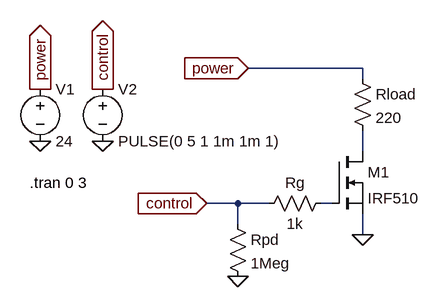
[diagram p0: schematic switch-nmos.asc]
switch-nmos.asc, the LTspice schematic file:
Version 4
SHEET 1 880 680
WIRE 240 80 64 80
WIRE 240 96 240 80
WIRE 240 208 240 176
WIRE 48 288 0 288
WIRE 96 288 48 288
WIRE 192 288 176 288
WIRE 48 320 48 288
WIRE 240 336 240 304
FLAG 240 336 0
FLAG 0 288 control
IOPIN 0 288 In
FLAG 64 80 power
IOPIN 64 80 In
FLAG -256 192 0
FLAG -256 112 power
IOPIN -256 112 Out
FLAG -160 192 0
FLAG -160 112 control
IOPIN -160 112 Out
FLAG 48 400 0
SYMBOL Res 224 80 R0
SYMATTR InstName Rload
SYMATTR Value 220
SYMBOL Res 192 272 R90
WINDOW 0 0 56 VBottom 2
WINDOW 3 32 56 VTop 2
SYMATTR InstName Rg
SYMATTR Value 1k
SYMBOL Voltage -256 96 R0
SYMATTR InstName V1
SYMATTR Value 24
SYMBOL Voltage -160 96 R0
SYMATTR InstName V2
SYMATTR Value PULSE(0 5 1 1m 1m 1)
SYMBOL nmos 192 208 R0
SYMATTR InstName M1
SYMATTR Value IRF510
SYMBOL Res 32 304 R0
SYMATTR InstName Rpd
SYMATTR Value 1Meg
TEXT -272 256 Left 2 !.tran 0 3

The netlist it stands for:
* switch-nmos.asc
Rload power N001 220
Rg N002 control 1k
V1 power 0 24
V2 control 0 PULSE(0 5 1 1m 1m 1)
M1 N001 N002 0 0 IRF510
Rpd control 0 1Meg
.model NMOS NMOS
.model PMOS PMOS
.lib standard.mos
.tran 0 3
.backanno
.end